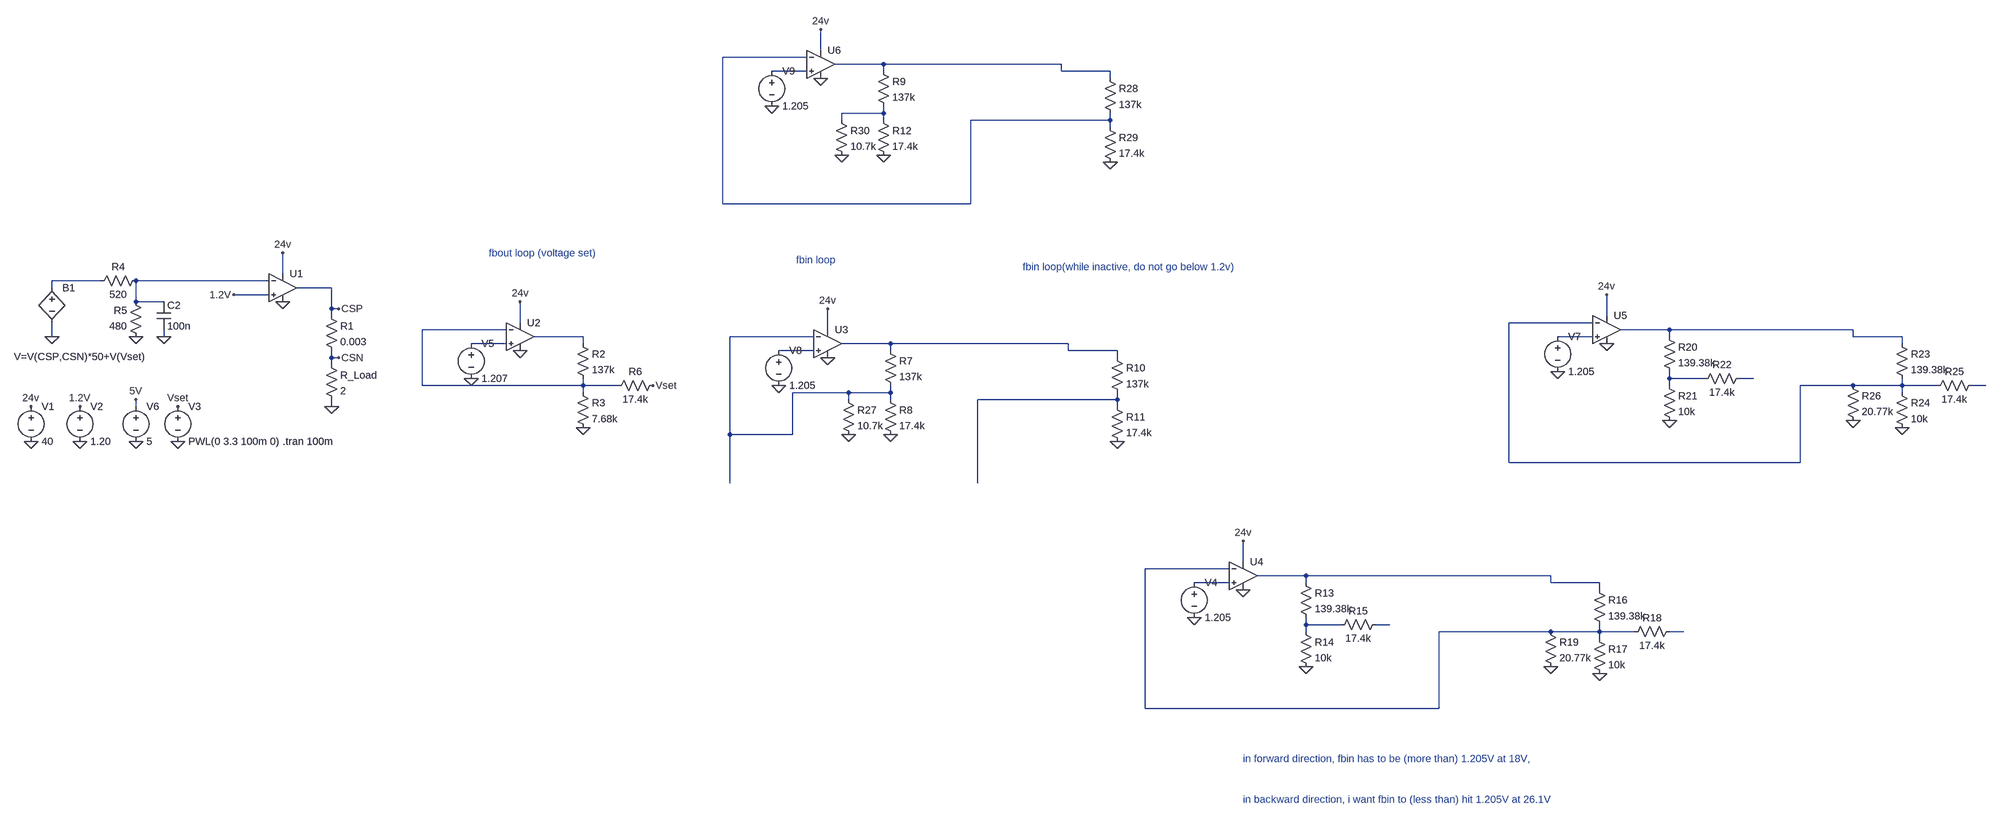
[diagram p0: schematic high level supercap model.asc]
high level supercap model.asc, the LTspice schematic file:
Version 4
SHEET 1 4548 1336
WIRE 1584 -400 1584 -448
WIRE 1552 -384 1360 -384
WIRE 1728 -368 1616 -368
WIRE 2288 -368 1728 -368
WIRE 1552 -352 1472 -352
WIRE 1728 -352 1728 -368
WIRE 2288 -352 2288 -368
WIRE 2400 -352 2288 -352
WIRE 2400 -336 2400 -352
WIRE 1728 -256 1728 -272
WIRE 1728 -256 1632 -256
WIRE 1632 -240 1632 -256
WIRE 1728 -240 1728 -256
WIRE 2400 -240 2400 -256
WIRE 2400 -240 2032 -240
WIRE 2400 -224 2400 -240
WIRE 1360 -48 1360 -384
WIRE 2032 -48 2032 -240
WIRE 2032 -48 1360 -48
WIRE 208 112 208 64
WIRE -208 128 -320 128
WIRE 176 128 -128 128
WIRE -320 144 -320 128
WIRE 320 144 240 144
WIRE 176 160 96 160
WIRE -128 176 -128 128
WIRE -64 176 -128 176
WIRE 320 192 320 144
WIRE 336 192 320 192
WIRE 320 208 320 192
WIRE 3536 208 3536 160
WIRE 848 224 848 176
WIRE 3504 224 3312 224
WIRE 816 240 624 240
WIRE 1600 240 1600 192
WIRE 3680 240 3568 240
WIRE 4240 240 3680 240
WIRE -320 256 -320 224
WIRE -64 256 -64 240
WIRE 992 256 880 256
WIRE 1568 256 1376 256
WIRE 3504 256 3424 256
WIRE 3680 256 3680 240
WIRE 4240 256 4240 240
WIRE 4352 256 4240 256
WIRE 816 272 736 272
WIRE 992 272 992 256
WIRE 1744 272 1632 272
WIRE 2304 272 1744 272
WIRE 4352 272 4352 256
WIRE 1568 288 1488 288
WIRE 1744 288 1744 272
WIRE 2304 288 2304 272
WIRE 2416 288 2304 288
WIRE 320 304 320 288
WIRE 336 304 320 304
WIRE 2416 304 2416 288
WIRE 320 320 320 304
WIRE 3680 352 3680 336
WIRE 3760 352 3680 352
WIRE 3872 352 3840 352
WIRE 624 368 624 240
WIRE 992 368 992 352
WIRE 992 368 624 368
WIRE 1072 368 992 368
WIRE 3680 368 3680 352
WIRE 4240 368 3984 368
WIRE 4352 368 4352 352
WIRE 4352 368 4240 368
WIRE 4432 368 4352 368
WIRE 4544 368 4512 368
WIRE 992 384 992 368
WIRE 1648 384 1520 384
WIRE 1744 384 1744 368
WIRE 1744 384 1648 384
WIRE 4352 384 4352 368
WIRE 1648 400 1648 384
WIRE 1744 400 1744 384
WIRE 2416 400 2416 384
WIRE 2416 400 2048 400
WIRE -128 416 -128 400
WIRE 320 416 320 400
WIRE 2416 416 2416 400
WIRE 1376 480 1376 256
WIRE 1520 480 1520 384
WIRE 1520 480 1376 480
WIRE 3312 544 3312 224
WIRE 3984 544 3984 368
WIRE 3984 544 3312 544
WIRE 1376 592 1376 480
WIRE 2048 592 2048 400
WIRE 2704 800 2704 752
WIRE 2672 816 2480 816
WIRE 2848 832 2736 832
WIRE 3408 832 2848 832
WIRE 2672 848 2592 848
WIRE 2848 848 2848 832
WIRE 3408 848 3408 832
WIRE 3520 848 3408 848
WIRE 3520 864 3520 848
WIRE 2848 944 2848 928
WIRE 2928 944 2848 944
WIRE 3040 944 3008 944
WIRE 2848 960 2848 944
WIRE 3408 960 3152 960
WIRE 3520 960 3520 944
WIRE 3520 960 3408 960
WIRE 3600 960 3520 960
WIRE 3712 960 3680 960
WIRE 3520 976 3520 960
WIRE 2480 1136 2480 816
WIRE 3152 1136 3152 960
WIRE 3152 1136 2480 1136
FLAG 320 416 0
FLAG 208 176 0
FLAG -256 496 0
FLAG -256 416 1.2V
FLAG 96 160 1.2V
FLAG -368 496 0
FLAG -368 416 24v
FLAG 208 64 24v
FLAG -128 496 0
FLAG -128 400 5V
FLAG -320 256 0
FLAG -128 256 0
FLAG -64 256 0
FLAG 336 192 CSP
FLAG 336 304 CSN
FLAG -32 496 0
FLAG -32 416 Vset
FLAG 848 288 0
FLAG 848 176 24v
FLAG 992 464 0
FLAG 736 352 0
FLAG 1600 304 0
FLAG 1600 192 24v
FLAG 1744 480 0
FLAG 1488 368 0
FLAG 2416 496 0
FLAG 1152 368 Vset
FLAG 2704 864 0
FLAG 2704 752 24v
FLAG 2848 1040 0
FLAG 2592 928 0
FLAG 3520 1056 0
FLAG 3408 1040 0
FLAG 3536 272 0
FLAG 3536 160 24v
FLAG 3680 448 0
FLAG 3424 336 0
FLAG 4352 464 0
FLAG 4240 448 0
FLAG 1648 480 0
FLAG 1584 -336 0
FLAG 1584 -448 24v
FLAG 1728 -160 0
FLAG 1472 -272 0
FLAG 2400 -144 0
FLAG 1632 -160 0
SYMBOL OpAmps\\UniversalOpAmp 208 144 R0
SYMATTR InstName U1
SYMBOL voltage -256 400 R0
WINDOW 123 0 0 Left 0
WINDOW 39 0 0 Left 0
SYMATTR InstName V2
SYMATTR Value 1.20
SYMBOL voltage -368 400 R0
WINDOW 123 0 0 Left 0
WINDOW 39 0 0 Left 0
SYMATTR InstName V1
SYMATTR Value 40
SYMBOL res 304 304 R0
SYMATTR InstName R_Load
SYMATTR Value 2
SYMBOL res 304 192 R0
SYMATTR InstName R1
SYMATTR Value 0.003
SYMBOL voltage -128 400 R0
SYMATTR InstName V6
SYMATTR Value 5
SYMBOL res -112 112 R90
WINDOW 0 0 56 VBottom 2
WINDOW 3 32 56 VTop 2
SYMATTR InstName R4
SYMATTR Value 520
SYMBOL res -112 272 R180
WINDOW 0 36 76 Left 2
WINDOW 3 36 40 Left 2
SYMATTR InstName R5
SYMATTR Value 480
SYMBOL cap -80 176 R0
SYMATTR InstName C2
SYMATTR Value 100n
SYMBOL bv -320 128 R0
WINDOW 3 -87 174 Left 2
SYMATTR Value V=V(CSP,CSN)*50+V(Vset)
SYMATTR InstName B1
SYMBOL voltage -32 400 R0
WINDOW 123 0 0 Left 0
WINDOW 39 0 0 Left 0
SYMATTR InstName V3
SYMATTR Value PWL(0 3.3 100m 0)
SYMBOL OpAmps\\UniversalOpAmp 848 256 R0
SYMATTR InstName U2
SYMBOL res 976 256 R0
SYMATTR InstName R2
SYMATTR Value 137k
SYMBOL res 976 368 R0
SYMATTR InstName R3
SYMATTR Value 7.68k
SYMBOL res 1168 352 R90
WINDOW 0 0 56 VBottom 2
WINDOW 3 32 56 VTop 2
SYMATTR InstName R6
SYMATTR Value 17.4k
SYMBOL voltage 736 256 R0
WINDOW 123 0 0 Left 0
WINDOW 39 0 0 Left 0
SYMATTR InstName V5
SYMATTR Value 1.207
SYMBOL OpAmps\\UniversalOpAmp 1600 272 R0
SYMATTR InstName U3
SYMBOL res 1728 272 R0
SYMATTR InstName R7
SYMATTR Value 137k
SYMBOL res 1728 384 R0
SYMATTR InstName R8
SYMATTR Value 17.4k
SYMBOL voltage 1488 272 R0
WINDOW 123 0 0 Left 0
WINDOW 39 0 0 Left 0
SYMATTR InstName V8
SYMATTR Value 1.205
SYMBOL res 2400 288 R0
SYMATTR InstName R10
SYMATTR Value 137k
SYMBOL res 2400 400 R0
SYMATTR InstName R11
SYMATTR Value 17.4k
SYMBOL OpAmps\\UniversalOpAmp 2704 832 R0
SYMATTR InstName U4
SYMBOL res 2832 832 R0
SYMATTR InstName R13
SYMATTR Value 139.38k
SYMBOL res 2832 944 R0
SYMATTR InstName R14
SYMATTR Value 10k
SYMBOL voltage 2592 832 R0
WINDOW 123 0 0 Left 0
WINDOW 39 0 0 Left 0
SYMATTR InstName V4
SYMATTR Value 1.205
SYMBOL res 3024 928 R90
WINDOW 0 0 56 VBottom 2
WINDOW 3 32 56 VTop 2
SYMATTR InstName R15
SYMATTR Value 17.4k
SYMBOL res 3504 848 R0
SYMATTR InstName R16
SYMATTR Value 139.38k
SYMBOL res 3504 960 R0
SYMATTR InstName R17
SYMATTR Value 10k
SYMBOL res 3696 944 R90
WINDOW 0 0 56 VBottom 2
WINDOW 3 32 56 VTop 2
SYMATTR InstName R18
SYMATTR Value 17.4k
SYMBOL res 3392 944 R0
SYMATTR InstName R19
SYMATTR Value 20.77k
SYMBOL OpAmps\\UniversalOpAmp 3536 240 R0
SYMATTR InstName U5
SYMBOL res 3664 240 R0
SYMATTR InstName R20
SYMATTR Value 139.38k
SYMBOL res 3664 352 R0
SYMATTR InstName R21
SYMATTR Value 10k
SYMBOL voltage 3424 240 R0
WINDOW 123 0 0 Left 0
WINDOW 39 0 0 Left 0
SYMATTR InstName V7
SYMATTR Value 1.205
SYMBOL res 3856 336 R90
WINDOW 0 0 56 VBottom 2
WINDOW 3 32 56 VTop 2
SYMATTR InstName R22
SYMATTR Value 17.4k
SYMBOL res 4336 256 R0
SYMATTR InstName R23
SYMATTR Value 139.38k
SYMBOL res 4336 368 R0
SYMATTR InstName R24
SYMATTR Value 10k
SYMBOL res 4528 352 R90
WINDOW 0 0 56 VBottom 2
WINDOW 3 32 56 VTop 2
SYMATTR InstName R25
SYMATTR Value 17.4k
SYMBOL res 4224 352 R0
SYMATTR InstName R26
SYMATTR Value 20.77k
SYMBOL res 1632 384 R0
SYMATTR InstName R27
SYMATTR Value 10.7k
SYMBOL OpAmps\\UniversalOpAmp 1584 -368 R0
SYMATTR InstName U6
SYMBOL res 1712 -368 R0
SYMATTR InstName R9
SYMATTR Value 137k
SYMBOL res 1712 -256 R0
SYMATTR InstName R12
SYMATTR Value 17.4k
SYMBOL voltage 1472 -368 R0
WINDOW 123 0 0 Left 0
WINDOW 39 0 0 Left 0
SYMATTR InstName V9
SYMATTR Value 1.205
SYMBOL res 2384 -352 R0
SYMATTR InstName R28
SYMATTR Value 137k
SYMBOL res 2384 -240 R0
SYMATTR InstName R29
SYMATTR Value 17.4k
SYMBOL res 1616 -256 R0
SYMATTR InstName R30
SYMATTR Value 10.7k
TEXT 208 496 Left 2 !.tran 100m
TEXT 776 64 Left 2 ;fbout loop (voltage set)
TEXT 1528 80 Left 2 ;fbin loop
TEXT 2200 96 Left 2 ;fbin loop(while inactive, do not go below 1.2v)
TEXT 2704 1264 Left 2 ;in forward direction, fbin has to be (more than) 1.205V at 18V, \n \n\nin backward direction, i want fbin to (less than) hit 1.205V at 26.1V

The netlist it stands for:
* high level supercap model.asc
XU1 1.2V N006 24v 0 CSP level1 Avol=1Meg GBW=10Meg Vos=0 En=0 Enk=0 In=0 Ink=0 Rin=500Meg  ; pins In+ In- V+ V- OUT
V2 1.2V 0 1.20
V1 24v 0 40
R_Load CSN 0 2
R1 CSP CSN 0.003
V6 5V 0 5
R4 N006 N005 520
R5 0 N006 480
C2 N006 0 100n
B1 N005 0 V=V(CSP,CSN)*50+V(Vset)
V3 Vset 0 PWL(0 3.3 100m 0)
XU2 N013 N008 24v 0 N010 level1 Avol=1Meg GBW=10Meg Vos=0 En=0 Enk=0 In=0 Ink=0 Rin=500Meg  ; pins In+ In- V+ V- OUT
R2 N010 N008 137k
R3 N008 0 7.68k
R6 Vset N008 17.4k
V5 N013 0 1.207
XU3 N015 N011 24v 0 N014 level1 Avol=1Meg GBW=10Meg Vos=0 En=0 Enk=0 In=0 Ink=0 Rin=500Meg  ; pins In+ In- V+ V- OUT
R7 N014 N011 137k
R8 N011 0 17.4k
V8 N015 0 1.205
R10 N014 N019 137k
R11 N019 0 17.4k
XU4 N022 N020 24v 0 N021 level1 Avol=1Meg GBW=10Meg Vos=0 En=0 Enk=0 In=0 Ink=0 Rin=500Meg  ; pins In+ In- V+ V- OUT
R13 N021 N023 139.38k
R14 N023 0 10k
V4 N022 0 1.205
R15 N024 N023 17.4k
R16 N021 N020 139.38k
R17 N020 0 10k
R18 N025 N020 17.4k
R19 N020 0 20.77k
XU5 N012 N007 24v 0 N009 level1 Avol=1Meg GBW=10Meg Vos=0 En=0 Enk=0 In=0 Ink=0 Rin=500Meg  ; pins In+ In- V+ V- OUT
R20 N009 N016 139.38k
R21 N016 0 10k
V7 N012 0 1.205
R22 N017 N016 17.4k
R23 N009 N007 139.38k
R24 N007 0 10k
R25 N018 N007 17.4k
R26 N007 0 20.77k
R27 N011 0 10.7k
XU6 N003 N001 24v 0 N002 level1 Avol=1Meg GBW=10Meg Vos=0 En=0 Enk=0 In=0 Ink=0 Rin=500Meg  ; pins In+ In- V+ V- OUT
R9 N002 N004 137k
R12 N004 0 17.4k
V9 N003 0 1.205
R28 N002 N001 137k
R29 N001 0 17.4k
R30 N004 0 10.7k
.tran 100m
* fbout loop (voltage set)
* fbin loop
* fbin loop(while inactive, do not go below 1.2v)
* in forward direction, fbin has to be (more than) 1.205V at 18V,
* in backward direction, i want fbin to (less than) hit 1.205V at 26.1V
.lib UniversalOpAmp1.lib
.backanno
.end